# EAGLE schematic Hormann_EE000591_reveng_schematic (EAGLE 9.1.1)
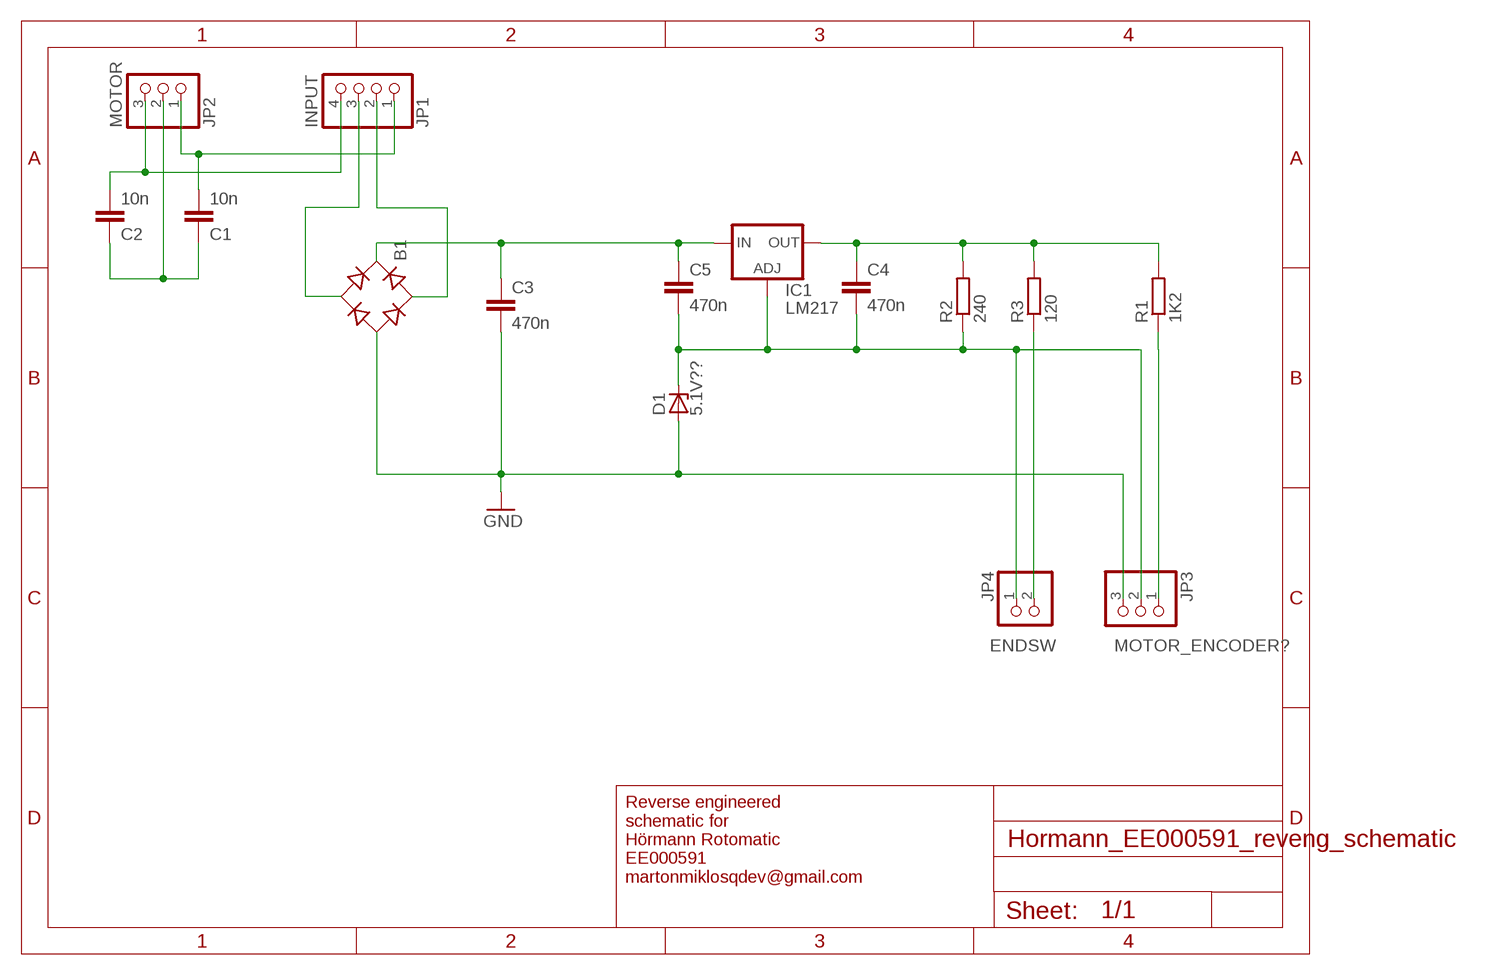
[diagram p0: schematic, sheet 1]

## Parts
B1  DBLS209G  [DBS]
C1  10n  C-EU025-025X050  [C025-025X050]
C2  10n  C-EU025-025X050  [C025-025X050]
C3  470n  C-EU025-030X050  [C025-030X050]
C4  470n  C-EU025-030X050  [C025-030X050]
C5  470n  C-EU025-030X050  [C025-030X050]
D1  5.1V??  ZENER-DIODEDO34-7  [DO34Z7]
IC1  LM217  LM317TL  [317TL]
JP1  INPUT  PINHD-1X4  [1X04]
JP2  MOTOR  PINHD-1X3  [1X03]
JP3  MOTOR_ENCODER?  PINHD-1X3  [1X03]
JP4  ENDSW  PINHD-1X2  [1X02]
R1  1K2  R-EU_0207/10  [0207/10]
R2  240  R-EU_0207/10  [0207/10]
R3  120  R-EU_0207/10  [0207/10]

## Nets
GND: B1.- C3.2 D1.A JP3.3
N$1: C1.2 JP1.1 JP2.1
N$2: C2.2 JP1.4 JP2.3
N$3: C1.1 C2.1 JP2.2
N$4: B1.AC1 JP1.2
N$5: B1.AC2 JP1.3
N$6: B1.+ C3.1 C5.1 IC1.3(IN)
N$7: C4.2 C5.2 D1.C IC1.1(ADJ) JP3.2 JP4.1 R2.1
N$8: C4.1 IC1.2(OUT) R1.2 R2.2 R3.2
N$9: JP3.1 R1.1
N$12: JP4.2 R3.1

## Notes on the sheet
- Reverse engineered
  schematic for 
  Hörmann Rotomatic 
  EE000591
  martonmiklosqdev@gmail.com

## Library data of the parts
B1 = rectifier:DB?*G: Single Phase 1.0 AMP Glass Passivated Bridge Rectifier Taiwan Semiconductor Co.,Ltd. - TSC Source: http://www.taiwansemi.com/TSCbig5/ezcatfiles/cust/img/img/db101g.pdf http://www.ts.com.tw/db/pictures/modules/PDT/PDT060207001/DBLS201G.pdf
C1-C5 = rcl:C-EU: CAPACITOR, European symbol
D1 = diode:ZENER-DIODE: Z-Diode
IC1 = v-reg:LM317TL: VOLTAGE REGULATOR
JP1 = pinhead:PINHD-1X4: PIN HEADER
JP2 JP3 = pinhead:PINHD-1X3: PIN HEADER
JP4 = pinhead:PINHD-1X2: PIN HEADER
R1-R3 = rcl:R-EU_: RESISTOR, European symbol